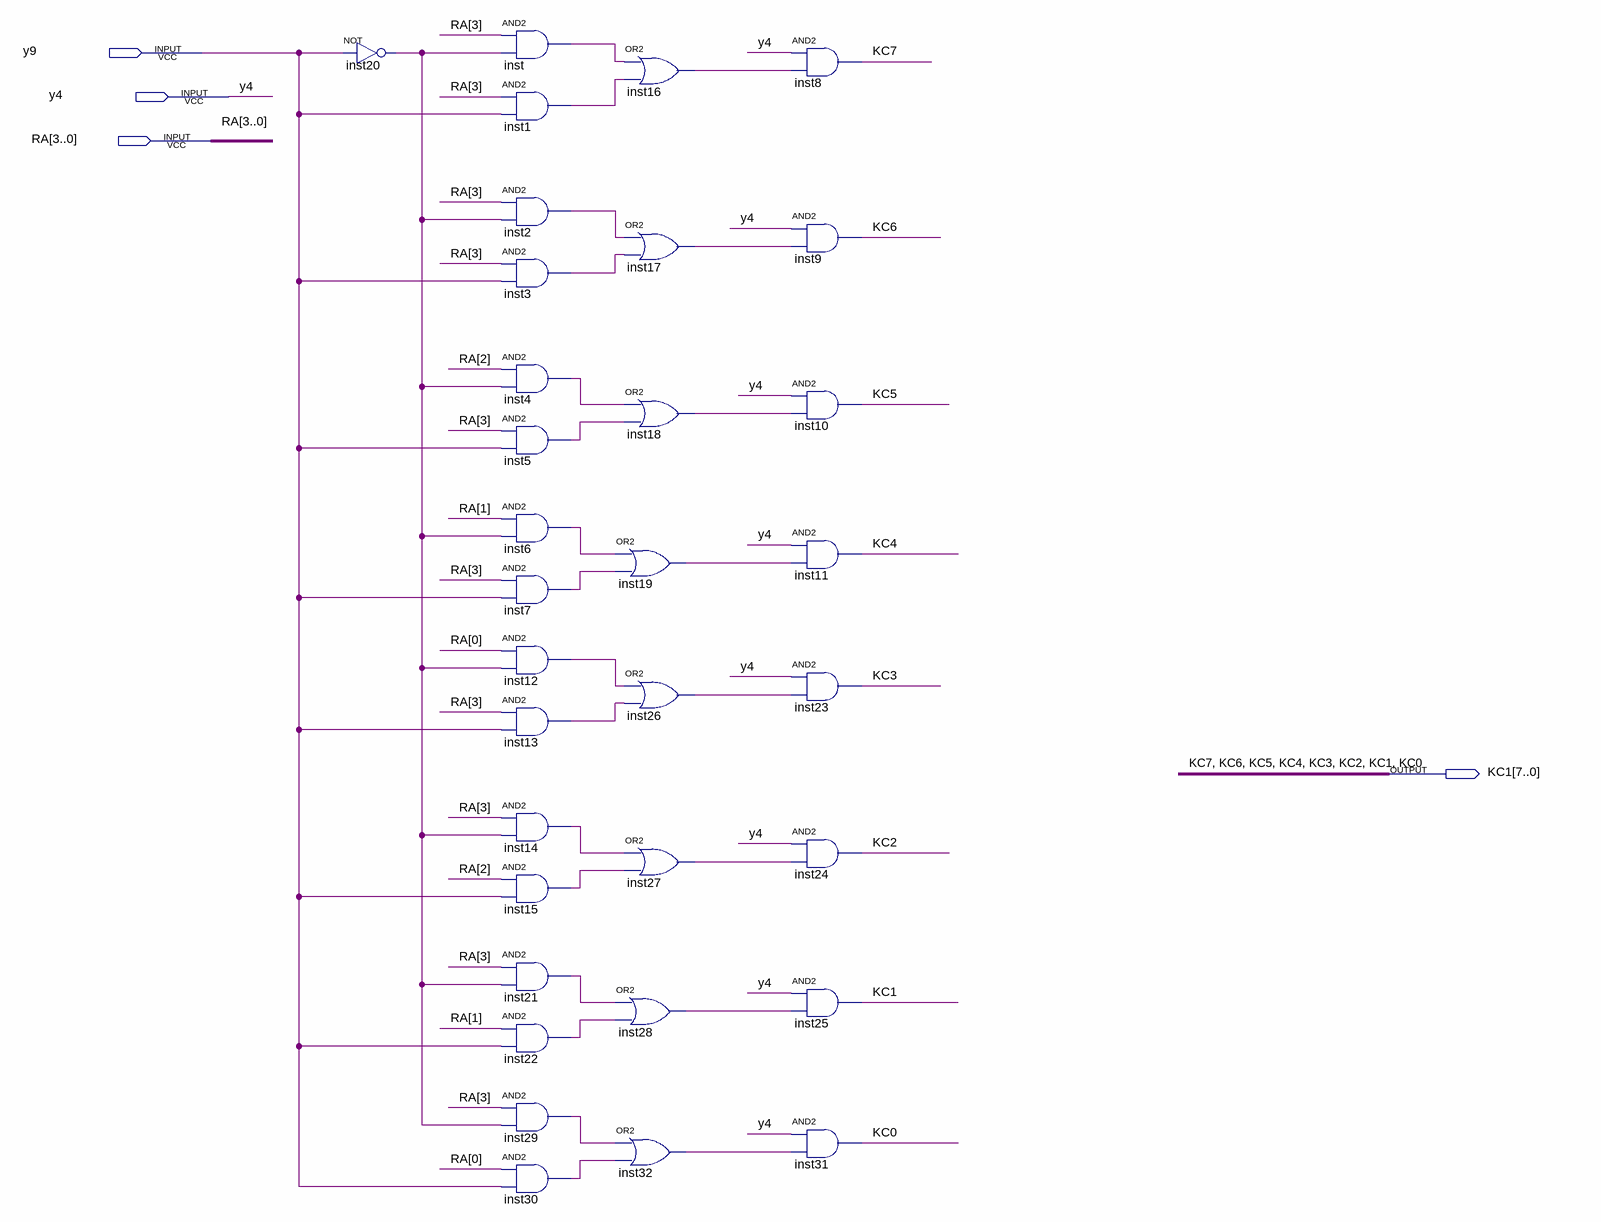
[diagram p0: schematic sheet]
// Quartus schematic KC1.bdf as structural Verilog: 33 symbols, 4 pins
module KC1 (
  input  y9,
  input  y4,
  input  [3:0] RA,
  output [7:0] KC1
);

  wire inst1_out, inst2_out, inst3_out, inst4_out, inst5_out, inst6_out, inst7_out, inst12_out, inst13_out,
       inst14_out, inst15_out, inst16_out, inst17_out, inst18_out, inst19_out, inst20_out, inst21_out,
       inst22_out, inst26_out, inst27_out, inst28_out, inst29_out, inst30_out, inst32_out, inst_out;

  not inst20 (inst20_out, y9);
  and inst (inst_out, RA[3], inst20_out);
  and inst1 (inst1_out, RA[3], y9);
  and inst2 (inst2_out, RA[3], inst20_out);
  and inst3 (inst3_out, RA[3], y9);
  and inst4 (inst4_out, RA[2], inst20_out);
  and inst5 (inst5_out, RA[3], y9);
  and inst6 (inst6_out, RA[1], inst20_out);
  and inst7 (inst7_out, RA[3], y9);
  and inst12 (inst12_out, RA[0], inst20_out);
  and inst13 (inst13_out, RA[3], y9);
  and inst14 (inst14_out, RA[3], inst20_out);
  and inst15 (inst15_out, RA[2], y9);
  and inst21 (inst21_out, RA[3], inst20_out);
  and inst22 (inst22_out, RA[1], y9);
  and inst29 (inst29_out, RA[3], inst20_out);
  and inst30 (inst30_out, RA[0], y9);
  or inst16 (inst16_out, inst_out, inst1_out);
  or inst17 (inst17_out, inst2_out, inst3_out);
  or inst18 (inst18_out, inst4_out, inst5_out);
  or inst19 (inst19_out, inst6_out, inst7_out);
  or inst26 (inst26_out, inst12_out, inst13_out);
  or inst27 (inst27_out, inst14_out, inst15_out);
  or inst28 (inst28_out, inst21_out, inst22_out);
  or inst32 (inst32_out, inst29_out, inst30_out);
  and inst8 (KC1[7], y4, inst16_out);
  and inst9 (KC1[6], y4, inst17_out);
  and inst10 (KC1[5], y4, inst18_out);
  and inst11 (KC1[4], y4, inst19_out);
  and inst23 (KC1[3], y4, inst26_out);
  and inst24 (KC1[2], y4, inst27_out);
  and inst25 (KC1[1], y4, inst28_out);
  and inst31 (KC1[0], y4, inst32_out);

  // Other names for the same wires on the sheet: KC0 = KC1[0]; KC1 = KC1[1]; KC2 = KC1[2]; KC3 = KC1[3]; KC4 = KC1[4];
  //   KC5 = KC1[5]; KC6 = KC1[6]; KC7 = KC1[7]
endmodule
